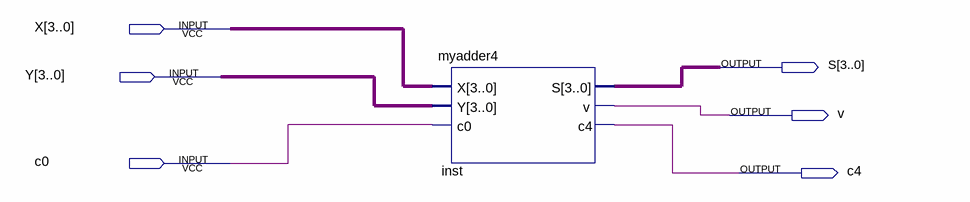
[diagram p0: schematic sheet]
// Quartus schematic Block2.bdf as structural Verilog: 1 symbols, 6 pins
module Block2 (
  input  [3:0] X,
  input  [3:0] Y,
  input  c0,
  output [3:0] S,
  output v,
  output c4
);

  myadder4 inst (.X(X), .Y(Y), .c0(c0), .S(S), .v(v), .c4(c4));
endmodule
